# Altium schematic sheet KSS.SchDoc
size A4; SheetNumber: 1; SheetTotal: 1
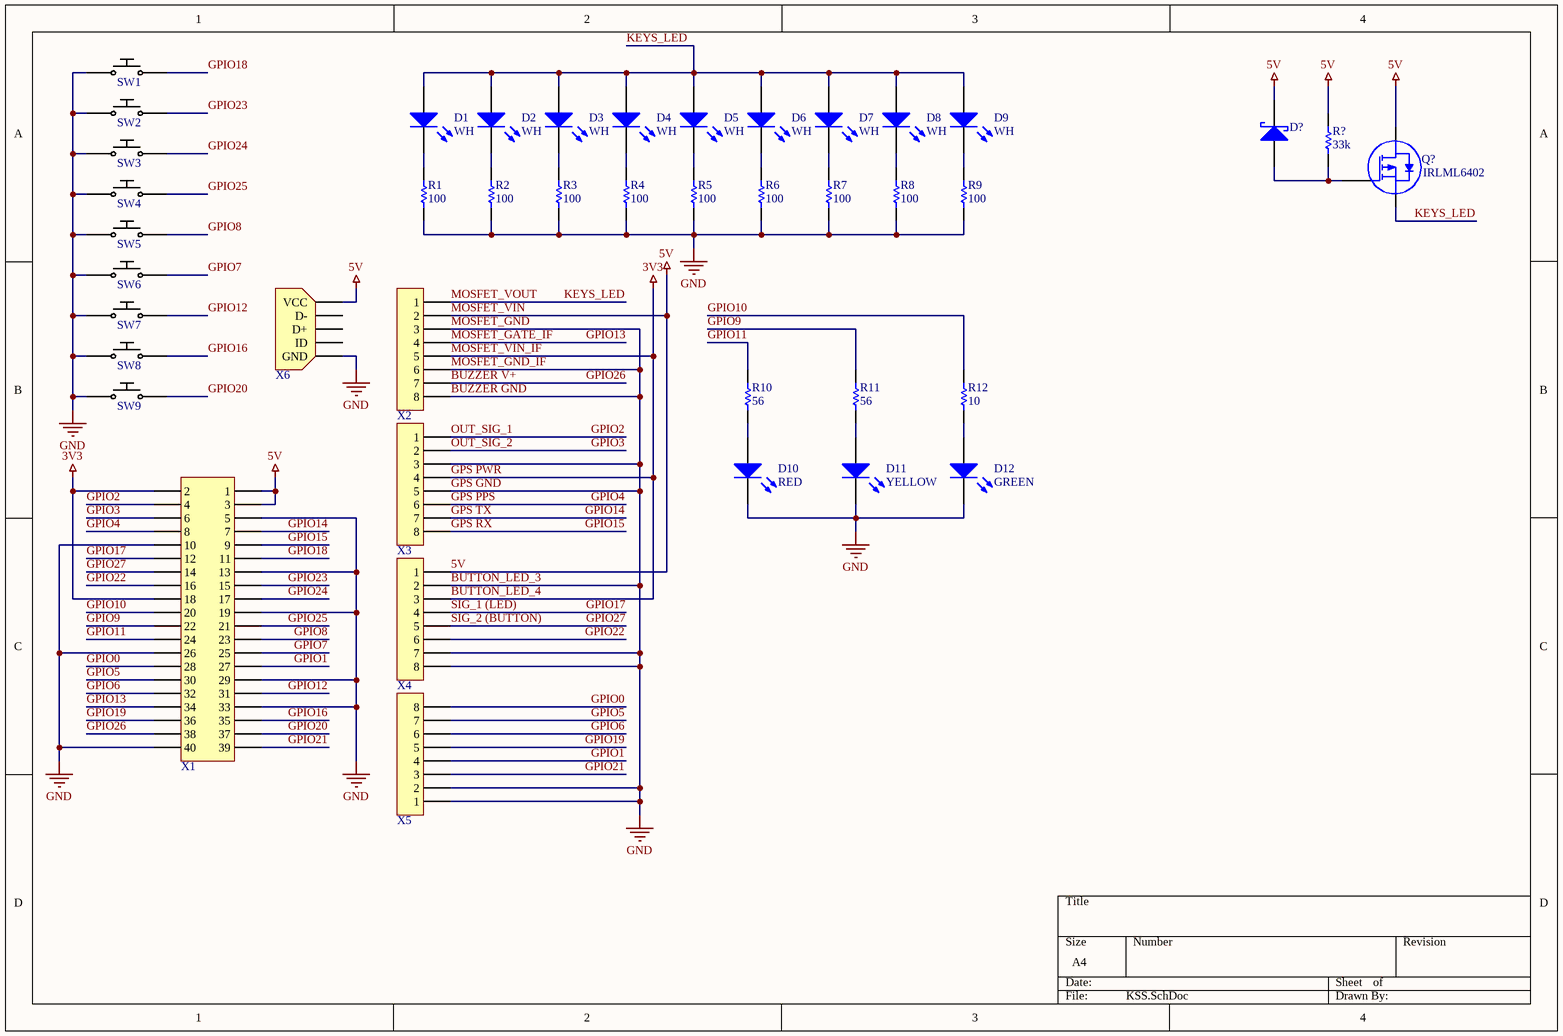
[diagram p0: KSS.SchDoc]

## Parts
D1  WH  [LED_1206]
D2  WH  [LED_1206]
D3  WH  [LED_1206]
D4  WH  [LED_1206]
D5  WH  [LED_1206]
D6  WH  [LED_1206]
D7  WH  [LED_1206]
D8  WH  [LED_1206]
D9  WH  [LED_1206]
D10  RED  [LED_1206]
D11  YELLOW  [LED_1206]
D12  GREEN  [LED_1206]
D?  SS14  [SMA/DO-214AC]  (value not drawn)
Q?  IRLML6402  [SOT23_3_PIN]
R1  Resistance: 100  [RES 1206]  (hidden comment: Resistor)
R2  Resistance: 100  [RES 1206]  (hidden comment: Resistor)
R3  Resistance: 100  [RES 1206]  (hidden comment: Resistor)
R4  Resistance: 100  [RES 1206]  (hidden comment: Resistor)
R5  Resistance: 100  [RES 1206]  (hidden comment: Resistor)
R6  Resistance: 100  [RES 1206]  (hidden comment: Resistor)
R7  Resistance: 100  [RES 1206]  (hidden comment: Resistor)
R8  Resistance: 100  [RES 1206]  (hidden comment: Resistor)
R9  Resistance: 100  [RES 1206]  (hidden comment: Resistor)
R10  Resistance: 56  [RES 1206]  (hidden comment: Resistor)
R11  Resistance: 56  [RES 1206]  (hidden comment: Resistor)
R12  Resistance: 10  [RES 1206]  (hidden comment: Resistor)
R?  Resistance: 33k  [RES 1206]  (hidden comment: Resistor)
SW1  Pushbutton  [Key switch Outemu]  (value not drawn)
SW2  Pushbutton  [Key switch Outemu]  (value not drawn)
SW3  Pushbutton  [Key switch Outemu]  (value not drawn)
SW4  Pushbutton  [Key switch Outemu]  (value not drawn)
SW5  Pushbutton  [Key switch Outemu]  (value not drawn)
SW6  Pushbutton  [Key switch Outemu]  (value not drawn)
SW7  Pushbutton  [Key switch Outemu]  (value not drawn)
SW8  Pushbutton  [Key switch Outemu]  (value not drawn)
SW9  Pushbutton  [Key switch Outemu]  (value not drawn)
X1  GoldPin_F_20x2  [GOLDPIN_F_20x2]  (value not drawn)
X2  ?  [SCREW_TERMINAL_X8 5,08mm]  (value not drawn)
X3  ?  [SCREW_TERMINAL_X8 5,08mm]  (value not drawn)
X4  ?  [SCREW_TERMINAL_X8 5,08mm]  (value not drawn)
X5  ?  [SCREW_TERMINAL_X8 5,08mm]  (value not drawn)
X6  USB_MICRO_B  [USB_MICRO_B_940 KEYSTONE]  (value not drawn)

## Nets
5V: D?.2(K) Q?.3(D) R?.1 X1.1 X1.3 X2.2 X4.1 X6.1(VCC)  [also labelled MOSFET_VIN]
BUTTON_LED_3: D10.2(K) D11.2(K) D12.2(K) R1.1 R2.1 R3.1 R4.1 R5.1 R6.1 R7.1 R8.1 R9.1 SW1.1 SW2.1 SW3.1 SW4.1 SW5.1 SW6.1 SW7.1 SW8.1 SW9.1 X1.5 X1.10 X1.13 X1.19 X1.26 X1.29 X1.33 X1.40 X2.3 X2.6 X2.8 X3.3 X3.5 X4.2 X4.7 X4.8 X5.1 X5.2 X6.5(GND)  [also labelled BUZZER GND, GND, GPS GND, MOSFET_GND, MOSFET_GND_IF]
BUTTON_LED_4: X1.2 X1.18 X2.5 X3.4 X4.3  [also labelled 3V3, GPS PWR, MOSFET_VIN_IF]
BUZZER V+: X1.38 X2.7  [also labelled GPIO26]
GPIO0: X1.28 X5.8
GPIO1: X1.27 X5.4
GPIO2: X1.4 X3.1  [also labelled OUT_SIG_1]
GPIO3: X1.6 X3.2  [also labelled OUT_SIG_2]
GPIO4: X1.8 X3.6  [also labelled GPS PPS]
GPIO5: X1.30 X5.7
GPIO6: X1.32 X5.6
GPIO7: SW6.2 X1.25
GPIO8: SW5.2 X1.23
GPIO9: R11.2 X1.22
GPIO10: R12.2 X1.20
GPIO11: R10.2 X1.24
GPIO12: SW7.2 X1.31
GPIO13: X1.34 X2.4  [also labelled MOSFET_GATE_IF]
GPIO14: X1.7 X3.7  [also labelled GPS TX]
GPIO15: X1.9 X3.8  [also labelled GPS RX]
GPIO16: SW8.2 X1.35
GPIO17: X1.12 X4.4  [also labelled SIG_1 (LED)]
GPIO18: SW1.2 X1.11
GPIO19: X1.36 X5.5
GPIO20: SW9.2 X1.37
GPIO21: X1.39 X5.3
GPIO22: X1.16 X4.6
GPIO23: SW2.2 X1.15
GPIO24: SW3.2 X1.17
GPIO25: SW4.2 X1.21
GPIO27: X1.14 X4.5  [also labelled SIG_2 (BUTTON)]
KEYS_LED: D1.1(A) D2.1(A) D3.1(A) D4.1(A) D5.1(A) D6.1(A) D7.1(A) D8.1(A) D9.1(A) Q?.2(S) X2.1  [also labelled MOSFET_VOUT]
NetD1_2: D1.2(K) R1.2
NetD2_2: D2.2(K) R2.2
NetD3_2: D3.2(K) R3.2
NetD4_2: D4.2(K) R4.2
NetD5_2: D5.2(K) R5.2
NetD6_2: D6.2(K) R6.2
NetD7_2: D7.2(K) R7.2
NetD8_2: D8.2(K) R8.2
NetD9_2: D9.2(K) R9.2
NetD10_1: D10.1(A) R10.1
NetD11_1: D11.1(A) R11.1
NetD12_1: D12.1(A) R12.1
NetD?_1: D?.1(A) Q?.1(G) R?.2

Not connected (* = marked no-connect by the designer): X6 2(D-) 3(D+) 4(ID)

## Library data of the parts
D1-D12 = Diode LED
D? = SS14: Schottky; VRRM: 40 V; VRMS: 28V; I(AV): 1 A; IFSM: 30 A; IR; TA=25: 0.5 mA; IR; TA=100: 20 mA; VF: 0.7V
Q? = IRLML6402: P-MOSFET; VDSS: -20 V; IDmax: -3.7A; RDSon: 0.065 Ohm; VGS: 12 V
X2-X5 = Connector x8